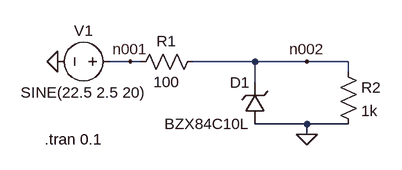
[diagram p0: schematic c02ex06s01.asc]
c02ex06s01.asc, the LTspice schematic file:
Version 4
SHEET 1 880 680
WIRE 16 128 -16 128
WIRE 32 128 16 128
WIRE 208 128 112 128
WIRE 288 128 208 128
WIRE 352 128 288 128
WIRE 352 144 352 128
WIRE 208 160 208 128
WIRE 288 224 208 224
WIRE 352 224 288 224
WIRE 288 240 288 224
FLAG -96 128 0
FLAG 288 240 0
FLAG 16 128 n001
FLAG 288 128 n002
SYMBOL zener 224 224 R180
WINDOW 0 24 64 Left 2
WINDOW 3 24 0 Left 2
SYMATTR InstName D1
SYMATTR Value BZX84C10L
SYMBOL res 16 144 R270
WINDOW 0 32 56 VTop 2
WINDOW 3 0 56 VBottom 2
SYMATTR InstName R1
SYMATTR Value 100
SYMBOL voltage 0 128 R90
WINDOW 0 -32 56 VBottom 2
WINDOW 3 32 56 VTop 2
WINDOW 123 0 0 Left 0
WINDOW 39 0 0 Left 0
SYMATTR InstName V1
SYMATTR Value SINE(22.5 2.5 20)
SYMBOL res 336 128 R0
SYMATTR InstName R2
SYMATTR Value 1k
TEXT -116 248 Left 2 !.tran 0.1

The netlist it stands for:
* c02ex06s01.asc
D1 0 n002 BZX84C10L
R1 n001 n002 100
V1 n001 0 SINE(22.5 2.5 20)
R2 n002 0 1k
.model D D
.lib standard.dio
.tran 0.1
.backanno
.end